# Altium project PROC114E3_SCH.PrjPcb (part 11 of 22)

## Sheet 24.SchDoc
size 513 x 386 mm
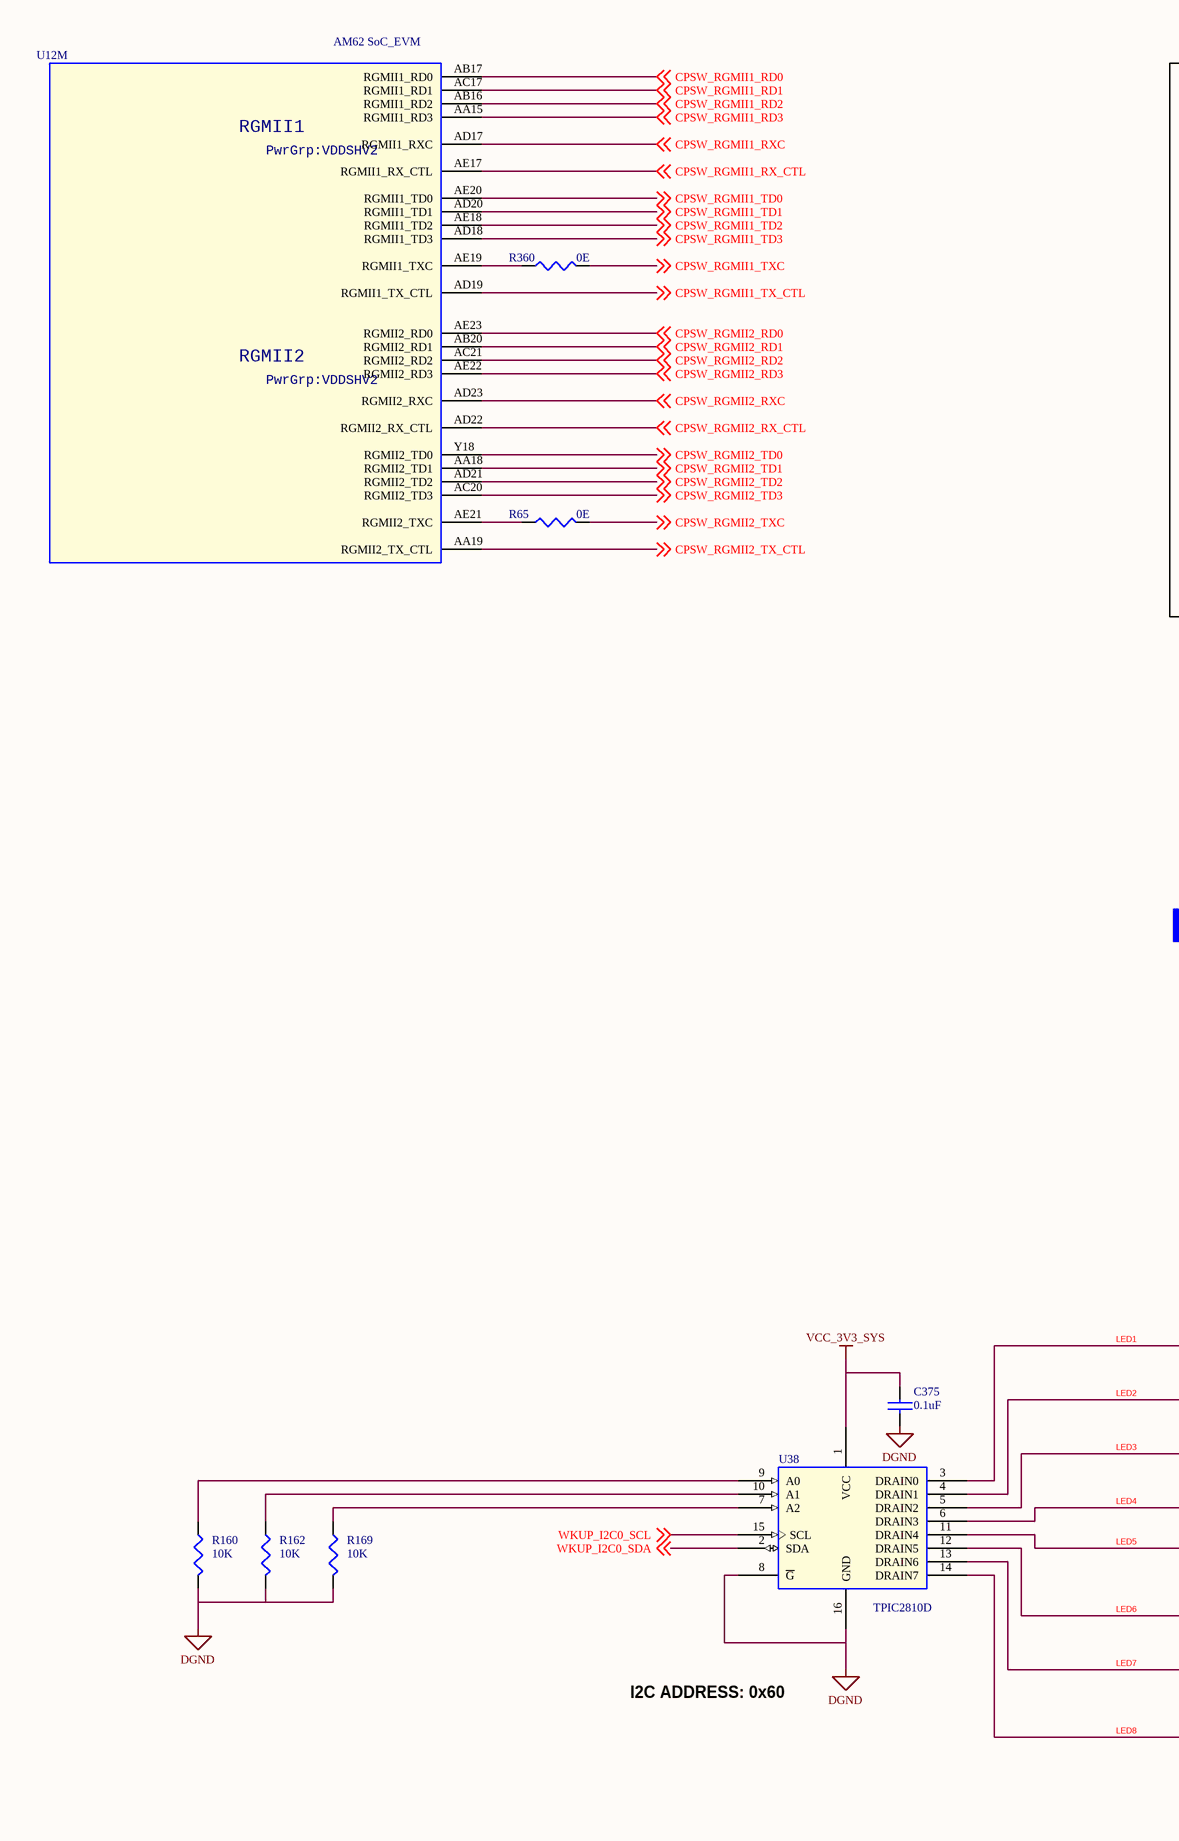
[diagram p37: 24.SchDoc, left]
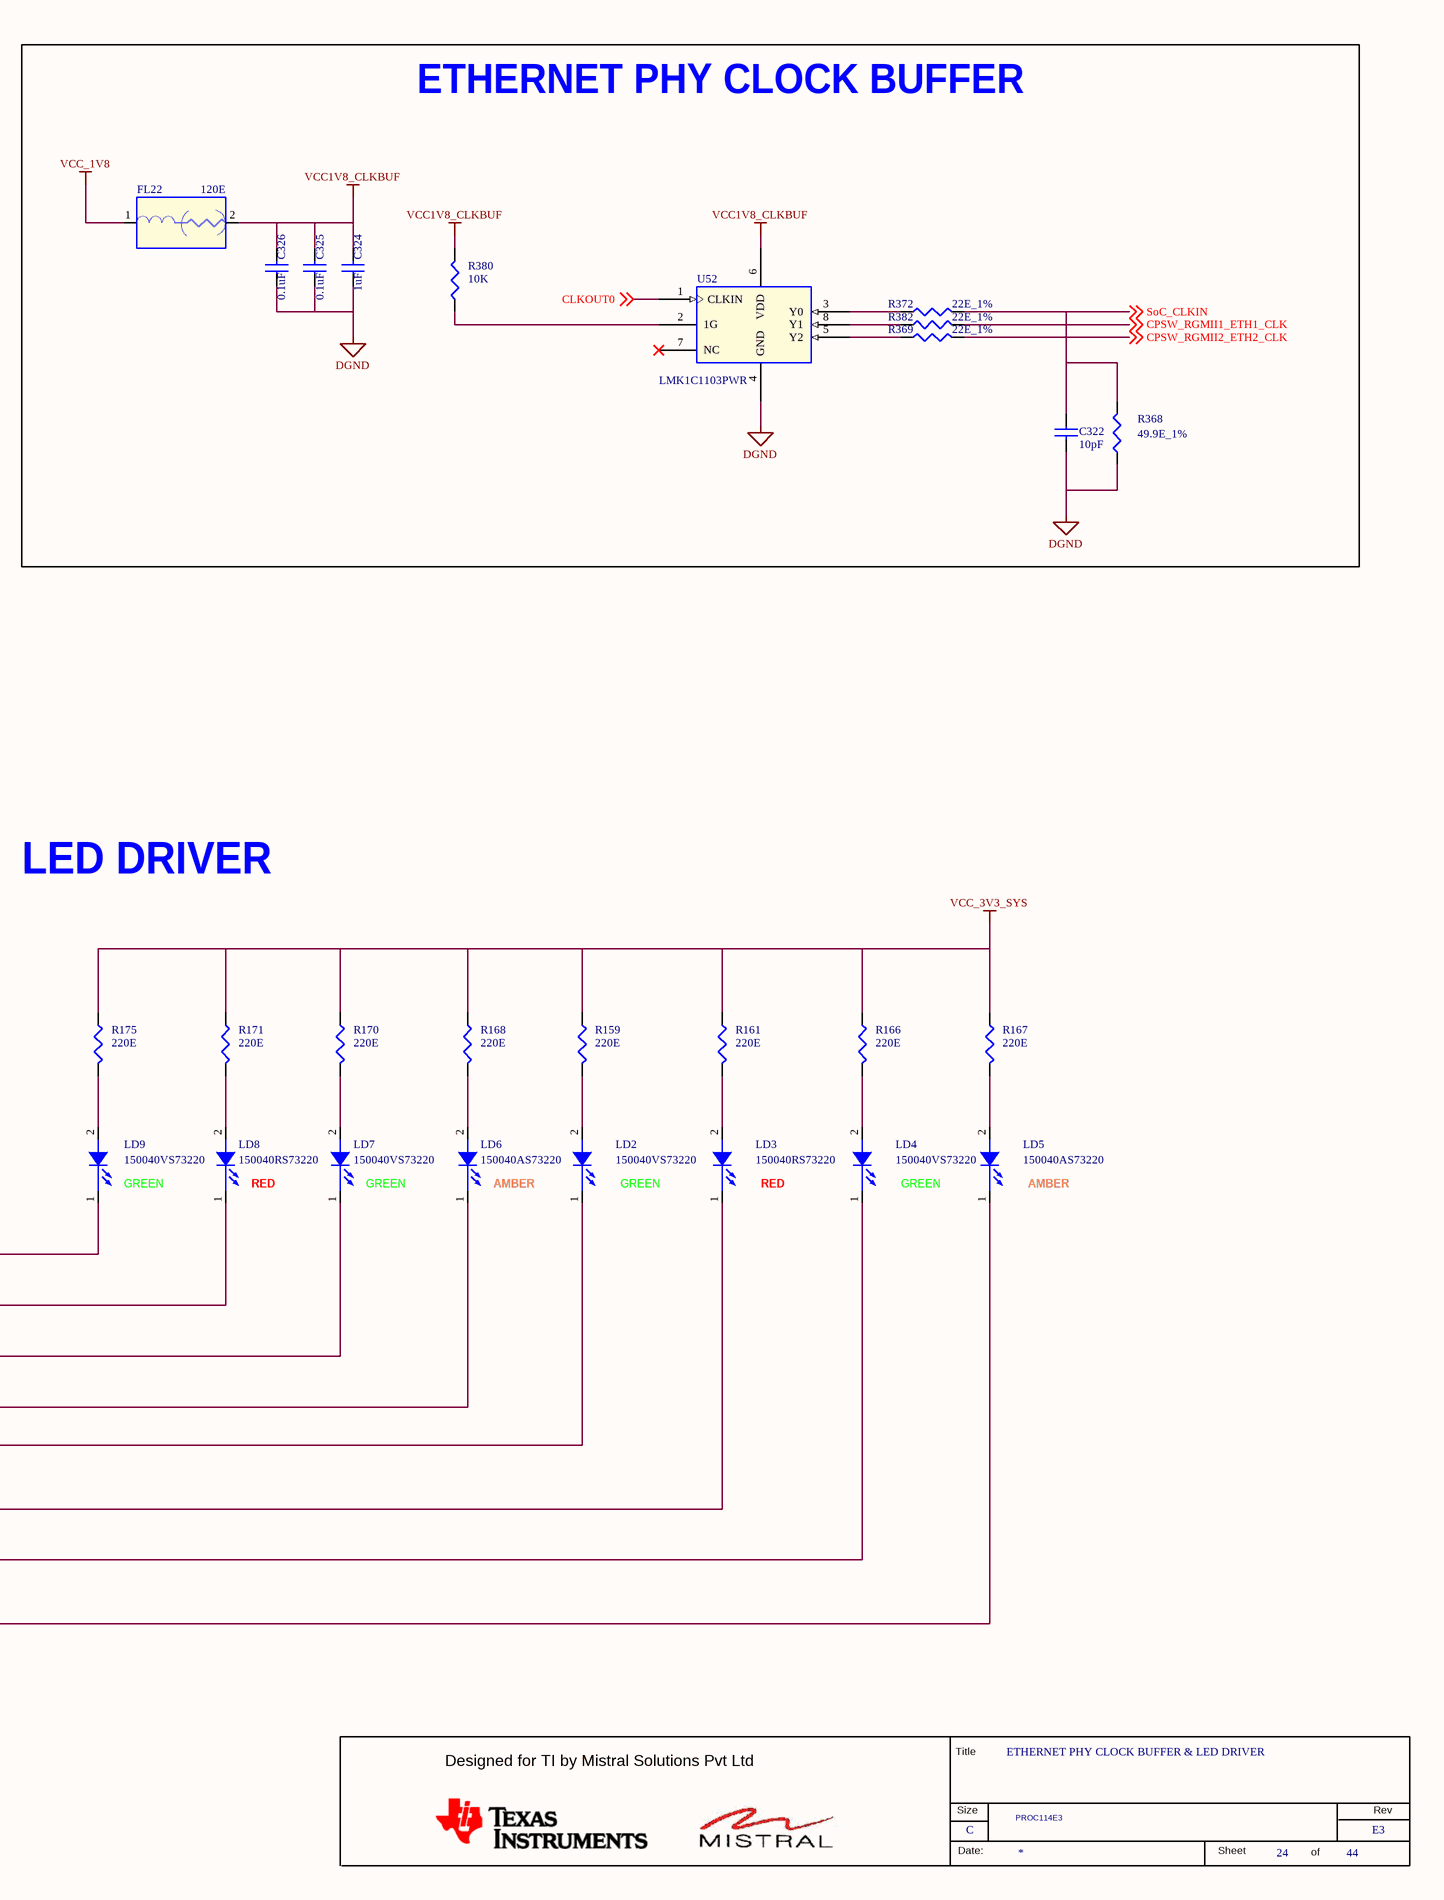
[diagram p38: 24.SchDoc, right]

### Parts
(Parts that share a designator on the sheet are numbered #1, #2 ... from top to bottom, then left to right.)
*#24  RevCode: E3  Title: ETHERNET PHY CLOCK BUFFER & LED DRIVER  Page Size: C  Page Number: 24  Page Count: 44  Variant Name: PROC114E3  (hidden comment: MISTRAL_TITLEBLK_CSIZE)  (graphical)
C322  10pF  [CAP0201_0-5]
C324  1uF  [CAP0201_0-5]
C325  0.1uF  [CAP0201_0-5]
C326  0.1uF  [CAP0201_0-5]
C375  0.1uF  [CAP0201_0-5]
FL22  120E  [EMIFIL_BLM15A_0402_0-6]
LD2  150040VS73220  [LED_150040GS73220_40X20_SMD_0-4]
LD3  150040RS73220  [LED_150040GS73220_40X20_SMD_0-4]
LD4  150040VS73220  [LED_150040GS73220_40X20_SMD_0-4]
LD5  150040AS73220  [LED_150040GS73220_40X20_SMD_0-4]
LD6  150040AS73220  [LED_150040GS73220_40X20_SMD_0-4]
LD7  150040VS73220  [LED_150040GS73220_40X20_SMD_0-4]
LD8  150040RS73220  [LED_150040GS73220_40X20_SMD_0-4]
LD9  150040VS73220  [LED_150040GS73220_40X20_SMD_0-4]
R65  0E  [RES0402_0-5]
R159  220E  [RES0402_0-5]
R160  10K  [RES0201_0-5]
R161  220E  [RES0402_0-5]
R162  10K  [RES0201_0-5]
R166  220E  [RES0402_0-5]
R167  220E  [RES0402_0-5]
R168  220E  [RES0402_0-5]
R169  10K  [RES0201_0-5]
R170  220E  [RES0402_0-5]
R171  220E  [RES0402_0-5]
R175  220E  [RES0402_0-5]
R360  0E  [RES0402_0-5]
R368  49.9E_1%  [RES0402_0-5]
R369  22E_1%  [RES0201_0-5]
R372  22E_1%  [RES0201_0-5]
R380  10K  [RES0201_0-5]
R382  22E_1%  [RES0201_0-5]
U12#2  AM62 SoC_EVM  [BGA425_19-68_510X510_0-7]  (part M of 18)
U38  TPIC2810D  [SOIC16_1-8]
U52  LMK1C1103PWR  [TSSOP8_25-59_125X180_1-2]

### Blocks framed on the sheet
ETHERNET PHY CLOCK BUFFER: C322 C324-C326 FL22 R368 R369 R372 R380 R382 U52

### Nets
DGND: C322.2 C324.1 C325.1 C326.1 C375.2 R160.2 R162.2 R169.2 R368.1 U38.8(~{G}) U38.16(GND) U52.4(GND)
VCC1V8_CLKBUF: C324.2 C325.2 C326.2 FL22.2 R380.2 U52.6(VDD)
VCC_1V8: FL22.1
VCC_3V3_SYS: C375.1 R159.1 R161.1 R166.1 R167.1 R168.1 R170.1 R171.1 R175.1 U38.1(VCC)
CLKOUT0: U52.1(CLKIN) ; off-sheet CLKOUT0
CPSW_RGMII1_ETH1_CLK: R382.2 ; off-sheet CPSW_RGMII1_ETH1_CLK
CPSW_RGMII1_RD0: U12#2.AB17(RGMII1_RD0) ; off-sheet CPSW_RGMII1_RD0
CPSW_RGMII1_RD1: U12#2.AC17(RGMII1_RD1) ; off-sheet CPSW_RGMII1_RD1
CPSW_RGMII1_RD2: U12#2.AB16(RGMII1_RD2) ; off-sheet CPSW_RGMII1_RD2
CPSW_RGMII1_RD3: U12#2.AA15(RGMII1_RD3) ; off-sheet CPSW_RGMII1_RD3
CPSW_RGMII1_RX_CTL: U12#2.AE17(RGMII1_RX_CTL) ; off-sheet CPSW_RGMII1_RX_CTL
CPSW_RGMII1_RXC: U12#2.AD17(RGMII1_RXC) ; off-sheet CPSW_RGMII1_RXC
CPSW_RGMII1_TD0: U12#2.AE20(RGMII1_TD0) ; off-sheet CPSW_RGMII1_TD0
CPSW_RGMII1_TD1: U12#2.AD20(RGMII1_TD1) ; off-sheet CPSW_RGMII1_TD1
CPSW_RGMII1_TD2: U12#2.AE18(RGMII1_TD2) ; off-sheet CPSW_RGMII1_TD2
CPSW_RGMII1_TD3: U12#2.AD18(RGMII1_TD3) ; off-sheet CPSW_RGMII1_TD3
CPSW_RGMII1_TX_CTL: U12#2.AD19(RGMII1_TX_CTL) ; off-sheet CPSW_RGMII1_TX_CTL
CPSW_RGMII1_TXC: R360.2 ; off-sheet CPSW_RGMII1_TXC
CPSW_RGMII2_ETH2_CLK: R369.2 ; off-sheet CPSW_RGMII2_ETH2_CLK
CPSW_RGMII2_RD0: U12#2.AE23(RGMII2_RD0) ; off-sheet CPSW_RGMII2_RD0
CPSW_RGMII2_RD1: U12#2.AB20(RGMII2_RD1) ; off-sheet CPSW_RGMII2_RD1
CPSW_RGMII2_RD2: U12#2.AC21(RGMII2_RD2) ; off-sheet CPSW_RGMII2_RD2
CPSW_RGMII2_RD3: U12#2.AE22(RGMII2_RD3) ; off-sheet CPSW_RGMII2_RD3
CPSW_RGMII2_RX_CTL: U12#2.AD22(RGMII2_RX_CTL) ; off-sheet CPSW_RGMII2_RX_CTL
CPSW_RGMII2_RXC: U12#2.AD23(RGMII2_RXC) ; off-sheet CPSW_RGMII2_RXC
CPSW_RGMII2_TD0: U12#2.Y18(RGMII2_TD0) ; off-sheet CPSW_RGMII2_TD0
CPSW_RGMII2_TD1: U12#2.AA18(RGMII2_TD1) ; off-sheet CPSW_RGMII2_TD1
CPSW_RGMII2_TD2: U12#2.AD21(RGMII2_TD2) ; off-sheet CPSW_RGMII2_TD2
CPSW_RGMII2_TD3: U12#2.AC20(RGMII2_TD3) ; off-sheet CPSW_RGMII2_TD3
CPSW_RGMII2_TX_CTL: U12#2.AA19(RGMII2_TX_CTL) ; off-sheet CPSW_RGMII2_TX_CTL
CPSW_RGMII2_TXC: R65.2 ; off-sheet CPSW_RGMII2_TXC
LED1: LD9.1(CATHODE) U38.3(DRAIN0)
LED2: LD8.1(CATHODE) U38.4(DRAIN1)
LED3: LD7.1(CATHODE) U38.5(DRAIN2)
LED4: LD6.1(CATHODE) U38.6(DRAIN3)
LED5: LD2.1(CATHODE) U38.11(DRAIN4)
LED6: LD3.1(CATHODE) U38.12(DRAIN5)
LED7: LD4.1(CATHODE) U38.13(DRAIN6)
LED8: LD5.1(CATHODE) U38.14(DRAIN7)
SoC_CLKIN: C322.1 R368.2 R372.2 ; off-sheet SoC_CLKIN
WKUP_I2C0_SCL: U38.15(SCL) ; off-sheet WKUP_I2C0_SCL
WKUP_I2C0_SDA: U38.2(SDA) ; off-sheet WKUP_I2C0_SDA
NetLD2_2: LD2.2(ANODE) R159.2
NetLD3_2: LD3.2(ANODE) R161.2
NetLD4_2: LD4.2(ANODE) R166.2
NetLD5_2: LD5.2(ANODE) R167.2
NetLD6_2: LD6.2(ANODE) R168.2
NetLD7_2: LD7.2(ANODE) R170.2
NetLD8_2: LD8.2(ANODE) R171.2
NetLD9_2: LD9.2(ANODE) R175.2
NetR65_1: R65.1 U12#2.AE21(RGMII2_TXC)
NetR160_1: R160.1 U38.9(A0)
NetR162_1: R162.1 U38.10(A1)
NetR169_1: R169.1 U38.7(A2)
NetR360_1: R360.1 U12#2.AE19(RGMII1_TXC)
NetR369_1: R369.1 U52.5(Y2)
NetR372_1: R372.1 U52.3(Y0)
NetR380_1: R380.1 U52.2(1G)
NetR382_1: R382.1 U52.8(Y1)

Not connected (* = marked no-connect by the designer): U52 7(NC)*

### Notes on the sheet
- LED DRIVER
- (near LD9) GREEN
- (near LD8) RED
- (near LD7) GREEN
- (near LD6) AMBER
- (near LD2) GREEN
- (near LD3) RED
- GREEN
- (near LD5) AMBER
- I2C ADDRESS: 0x60
- (in symbol AM62-EVM_BGA425, part M) RGMII1; PwrGrp:VDDSHV2; RGMII2
- (in symbol MISTRAL_TITLEBLK_CSIZE) Title; Designed for TI by Mistral Solutions Pvt Ltd; Size; Rev; Date:; Sheet; of

### Library data of the parts
*#24 = MISTRAL_TITLEBLK_CSIZE: Issue: 1.0; Page Create Date: March  8, 1995; Page Modify Date: *; Schematic Page Count: 44; Schematic Page Number: 24
C322 = CAP_Dup2: CAP CERAMIC 10pF 25V 5% HI-Q C0G(NP0) 0201; Part_type: CAPACITORS\CERAMIC; Mfr_part_number: GJM0335C1E100JB01D; Mfr_name: MURATA; Mistral Part No: 120016120010-R; Custom_Duty: 15%; Customs_HS_Code: 85322990; Wattage: NA; Project: OCTBTS5200; Footprint Path: Y:\MIS_DATABASE\Library\ALTIUM_TOOL\PCB_FOOTPRINTS\Altium_Footprint_Lib.PcbLib; Library Path: Y:\MIS_DATABASE\Library\ALTIUM_TOOL\SCHEMATICS_PARTS\MS_DISCRETE_Library.schlib; MECHANICAL 3D STEP FILE: CAP0201_0-5; Chkd/date: VASANTHA/081216; Crtd /date: MANIRAJA/081216; Datasheet: Y:\MIS_DATABASE\DATASHEETS\CAPACITORS\MURATA-GXX-SER_NOV17.PDF; Temperature: -55°C+125°C; Weight: 0.33mg; Height: 0.33MM; Library Ref: CAP; Distributor_part_number: 490-13312-1-ND; Distributor_name: DIGIKEY; Package: 0201; Voltage: 25V; Tolerance: 5%; Footprint Ref: CAP0201_0-5; PCB Footprint: CAP0201_0-5
C324 = CAP_Dup2: CAP CERAMIC 1uF 16V 20% X5R 0201; Mistral Part No: 120018090038-R; Mfr_name: MURATA; Mfr_part_number: GRM033R61C105ME15D; Part_type: CAPACITORS\CERAMIC; Project: QCS610_NANOSOM; Wattage: NA; Customs_HS_Code: 85322990; Custom_Duty: 15%; Footprint Ref: CAP0201_0-5; Library Ref: CAP; Tolerance: 20%; Voltage: 16V; Package: 0201; Distributor_name: DIGIKEY; Distributor_part_number: 490-18654-1-ND; Height: 0.39MM; Weight: 0.33mg; Temperature: -55°C+85°C; Datasheet: Y:\MIS_DATABASE\DATASHEETS\CAPACITORS\GRM033R61C105ME15.PDF; Crtd /date: ALVY/260520; Chkd/date: MANIRAJA/300520; MECHANICAL 3D STEP FILE: CAP0201_0-5; Library Path: Y:\MIS_DATABASE\Library\ALTIUM_TOOL\SCHEMATICS_PARTS\MS_DISCRETE_Library.schlib; Footprint Path: Y:\MIS_DATABASE\Library\ALTIUM_TOOL\PCB_FOOTPRINTS\Altium_Footprint_Lib.PcbLib; PCB Footprint: CAP0201_0-5
C325 C326 C375 = CAP_Dup2: CAP CERAMIC 0.1uF 16V 10% X5R 0201; Alt_Mfr_part_number: CC0402KRX5R8BB104; Mistral Part No: 120009030072-R; Mfr_name: MURATA; Mfr_part_number: GRM033R61C104KE14D; Part_type: CAPACITORS\CERAMIC; Alt_Mfr_name: YAGEO AMERICA; Project: TI_MAXIE_CPB; Wattage: NA; Customs_HS_Code: 85322990; Custom_Duty: 15%; Tolerance: 10%; Voltage: 16V; Package: 0201; Distributor_name: DIGIKEY; Distributor_part_number: 490-14305-1-ND; Height: 0.33MM; Weight: 0.33mg; Temperature: -55°C+85°C; Datasheet: Y:\MIS_DATABASE\DATASHEETS\CAPACITORS\GRM033R61C104KE14.PDF; Crtd /date: MANIRAJA/230118; Chkd/date: MANIRAJA/230118; MECHANICAL 3D STEP FILE: CAP0201_0-5; Library Ref: CAP; Footprint Ref: CAP0201_0-5; Library Path: Y:\MIS_DATABASE\Library\ALTIUM_TOOL\SCHEMATICS_PARTS\MS_DISCRETE_Library.schlib; Footprint Path: Y:\MIS_DATABASE\Library\ALTIUM_TOOL\PCB_FOOTPRINTS\Altium_Footprint_Lib.PcbLib; PCB Footprint: CAP0201_0-5
FL22 = EMIFILTER_IND: IND FERRITE BEAD CHIP 120E 2A 0402; Mistral Part No: 130013060022-R; Mfr_name: MURATA; Mfr_part_number: BLM15PX121SN1D; Part_type: INDUCTOR; Project: GEN_3-8; Tolerance: 25%; Voltage: NA; Customs_HS_Code: 85369090; Custom_Duty: 24%; Wattage: NA; Package: 0402; Distributor_name: DIGIKEY; Distributor_part_number: 490-9656-1-ND; Library Ref: EMIFILTER_IND; Height: 0.55MM; Weight: 1mg; Temperature: -55°C+125°C; Datasheet: Y:\MIS_DATABASE\DATASHEETS\DISCRETES\INDUCTORS\BLM15-SN1-SER.PDF; Crtd /date: USMAN/170613; Chkd/date: NAVEED/241114; Footprint Ref: EMIFIL_BLM15A_0402_0-6; MECHANICAL 3D STEP FILE: EMIFIL_BLM15A_0402_0-6; Library Path: Y:\MIS_DATABASE\Library\ALTIUM_TOOL\SCHEMATICS_PARTS\MS_FILTER_Library.schlib; Footprint Path: Y:\MIS_DATABASE\Library\ALTIUM_TOOL\PCB_FOOTPRINTS\Altium_Footprint_Lib.PcbLib; PCB Footprint: EMIFIL_BLM15A_0402_0-6
LD2 LD4 LD7 = DIODE_LED: DIODE LED BRIGHT GREEN SMD; Part_type: OPTO\LED; Mfr_name: WURTH ELECTRONIK; Mistral Part No: 130020110071-R; Custom_Duty: 24%; Customs_HS_Code: 85439000; Wattage: NA; Project: AM64X_SKEVM; Footprint Path: Y:\MIS_DATABASE\Library\ALTIUM_TOOL\PCB_FOOTPRINTS\Altium_Footprint_Lib.PcbLib; Library Path: Y:\MIS_DATABASE\Library\ALTIUM_TOOL\SCHEMATICS_PARTS\MS_OPTO_Library.schlib; MECHANICAL 3D STEP FILE: LED_150040GS73220_40X20_SMD_0-4; Chkd/date: MANIRAJA/261120; Crtd /date: ALVY/261120; Datasheet: Y:\MIS_DATABASE\DATASHEETS\DISCRETES\LEDS\150040VS73220.PDF; Temperature: -40°C+85°C; Weight: 29.3mg; Height: 0.35MM; Library Ref: DIODE_LED; Distributor_part_number: 732-13425-1-ND; Distributor_name: DIGIKEY; Package: SMD; Voltage: NA; Tolerance: NA; Mfr_part_number: 150040VS73220; Footprint Ref: LED_150040GS73220_40X20_SMD_0-4; PCB Footprint: LED_150040GS73220_40X20_SMD_0-4
LD3 = DIODE_LED: DIODE LED RED SMD; Mistral Part No: 130020090020-R; Mfr_name: WURTH ELECTRONICS; Part_type: OPTO\LED; Project: AM64X_SKEVM; Tolerance: NA; Customs_HS_Code: 85439000; Custom_Duty: 24%; Footprint Ref: LED_150040GS73220_40X20_SMD_0-4; Mfr_part_number: 150040RS73220; Voltage: NA; Wattage: NA; Package: SMD; Distributor_name: DIGIKEY; Distributor_part_number: 732-13422-1-ND; Library Ref: DIODE_LED; Height: 0.35MM; Weight: 29.3mg; Temperature: -40°C+85°C; Datasheet: Y:\MIS_DATABASE\DATASHEETS\DISCRETES\LEDS\150040RS73220.PDF; Crtd /date: ALVY/100920; Chkd/date: MANIRAJA/100920; MECHANICAL 3D STEP FILE: LED_150040GS73220_40X20_SMD_0-4; Library Path: Y:\MIS_DATABASE\Library\ALTIUM_TOOL\SCHEMATICS_PARTS\MS_OPTO_Library.schlib; Footprint Path: Y:\MIS_DATABASE\Library\ALTIUM_TOOL\PCB_FOOTPRINTS\Altium_Footprint_Lib.PcbLib; PCB Footprint: LED_150040GS73220_40X20_SMD_0-4
LD5 LD6 = DIODE_LED: DIODE LED AMBER SMD; Part_type: OPTO\LED; Mfr_name: WURTH ELECTRONICS; Mistral Part No: 130020090022-R; Custom_Duty: 24%; Customs_HS_Code: 85439000; Wattage: NA; Project: AM64X_SKEVM; Footprint Path: Y:\MIS_DATABASE\Library\ALTIUM_TOOL\PCB_FOOTPRINTS\Altium_Footprint_Lib.PcbLib; Library Path: Y:\MIS_DATABASE\Library\ALTIUM_TOOL\SCHEMATICS_PARTS\MS_OPTO_Library.schlib; MECHANICAL 3D STEP FILE: LED_150040GS73220_40X20_SMD_0-4; Chkd/date: MANIRAJA/100920; Crtd /date: ALVY/100920; Datasheet: Y:\MIS_DATABASE\DATASHEETS\DISCRETES\LEDS\150040AS73220.PDF; Temperature: -40°C+85°C; Weight: 29.3mg; Height: 0.35MM; Library Ref: DIODE_LED; Distributor_part_number: 732-13423-1-ND; Distributor_name: DIGIKEY; Package: SMD; Voltage: NA; Tolerance: NA; Mfr_part_number: 150040AS73220; Footprint Ref: LED_150040GS73220_40X20_SMD_0-4; PCB Footprint: LED_150040GS73220_40X20_SMD_0-4
LD8 = DIODE_LED: DIODE LED RED SMD; Part_type: OPTO\LED; Mfr_name: WURTH ELECTRONICS; Mistral Part No: 130020090020-R; Custom_Duty: 24%; Customs_HS_Code: 85439000; Wattage: NA; Project: AM64X_SKEVM; Footprint Path: Y:\MIS_DATABASE\Library\ALTIUM_TOOL\PCB_FOOTPRINTS\Altium_Footprint_Lib.PcbLib; Library Path: Y:\MIS_DATABASE\Library\ALTIUM_TOOL\SCHEMATICS_PARTS\MS_OPTO_Library.schlib; MECHANICAL 3D STEP FILE: LED_150040GS73220_40X20_SMD_0-4; Chkd/date: MANIRAJA/100920; Crtd /date: ALVY/100920; Datasheet: Y:\MIS_DATABASE\DATASHEETS\DISCRETES\LEDS\150040RS73220.PDF; Temperature: -40°C+85°C; Weight: 29.3mg; Height: 0.35MM; Library Ref: DIODE_LED; Distributor_part_number: 732-13422-1-ND; Distributor_name: DIGIKEY; Package: SMD; Voltage: NA; Tolerance: NA; Mfr_part_number: 150040RS73220; Footprint Ref: LED_150040GS73220_40X20_SMD_0-4; PCB Footprint: LED_150040GS73220_40X20_SMD_0-4
LD9 = DIODE_LED: DIODE LED BRIGHT GREEN SMD; Mistral Part No: 130020110071-R; Mfr_name: WURTH ELECTRONIK; Part_type: OPTO\LED; Project: AM64X_SKEVM; Tolerance: NA; Customs_HS_Code: 85439000; Custom_Duty: 24%; Footprint Ref: LED_150040GS73220_40X20_SMD_0-4; Mfr_part_number: 150040VS73220; Voltage: NA; Wattage: NA; Package: SMD; Distributor_name: DIGIKEY; Distributor_part_number: 732-13425-1-ND; Library Ref: DIODE_LED; Height: 0.35MM; Weight: 29.3mg; Temperature: -40°C+85°C; Datasheet: Y:\MIS_DATABASE\DATASHEETS\DISCRETES\LEDS\150040VS73220.PDF; Crtd /date: ALVY/261120; Chkd/date: MANIRAJA/261120; MECHANICAL 3D STEP FILE: LED_150040GS73220_40X20_SMD_0-4; Library Path: Y:\MIS_DATABASE\Library\ALTIUM_TOOL\SCHEMATICS_PARTS\MS_OPTO_Library.schlib; Footprint Path: Y:\MIS_DATABASE\Library\ALTIUM_TOOL\PCB_FOOTPRINTS\Altium_Footprint_Lib.PcbLib; PCB Footprint: LED_150040GS73220_40X20_SMD_0-4
R65 R360 = RESISTOR_Dup6: RES 0E 1/16W JUMPER 0402; Part_type: RESISTORS\FIXED; Mfr_part_number: CRCW04020000Z0ED; Mfr_name: VISHAY; Mistral Part No: 110010080019-R; SIGNAL_MODEL: RESISTOR_RES0402_0-5_0E_0E; Custom_Duty: 15%; Customs_HS_Code: 85332119; Voltage: NA; Project: PB_BUGBASE; Footprint Path: Y:\MIS_DATABASE\Library\ALTIUM_TOOL\PCB_FOOTPRINTS\Altium_Footprint_Lib.PcbLib; Library Path: Y:\MIS_DATABASE\Library\ALTIUM_TOOL\SCHEMATICS_PARTS\MS_DISCRETE_Library.schlib; MECHANICAL 3D STEP FILE: RES0402_0-5; Chkd/date: VASANTHA/201216; Crtd /date: MUDDU/190810; Datasheet: Y:\MIS_DATABASE\DATASHEETS\RESISTORS\CRCW0603.PDF; Temperature: -55°C+155°C; Weight: 0.65mg; Height: 0.40MM; Library Ref: RESISTOR; Distributor_part_number: 541-0.0JCT-ND; Distributor_name: DIGIKEY; Package: 0402; Wattage: 1/16W; Tolerance: NA; Footprint Ref: RES0402_0-5; PCB Footprint: RES0402_0-5
R159 R168 R170 R171 R175 = RESISTOR_Dup6: RES 220E 1/10W 5% 0402; Part_type: RESISTORS\FIXED; Mfr_part_number: ERJ-2GEJ221X; Mfr_name: PANASONIC-ECG; Mistral Part No: 110009030506-R; Custom_Duty: 15%; Customs_HS_Code: 85332119; Voltage: NA; Project: RED EYE; Footprint Path: Y:\MIS_DATABASE\Library\ALTIUM_TOOL\PCB_FOOTPRINTS\Altium_Footprint_Lib.PcbLib; Library Path: Y:\MIS_DATABASE\Library\ALTIUM_TOOL\SCHEMATICS_PARTS\MS_DISCRETE_Library.schlib; MECHANICAL 3D STEP FILE: RES0402_0-5; Chkd/date: VASANTHA/291216; Crtd /date: GEETHA/260406; Datasheet: Y:\MIS_DATABASE\DATASHEETS\RESISTORS\PAN-ERJSER_NOV17.PDF; Temperature: -55°C+155°C; Weight: 0.8mg; Height: 0.40MM; Footprint Ref: RES0402_0-5; Library Ref: RESISTOR; Distributor_part_number: P220JCT-ND; Distributor_name: DIGIKEY; Package: 0402; Wattage: 1/10W; Tolerance: 5%; PCB Footprint: RES0402_0-5; Manufacturer: PANASONIC-ECG
R160 R380 = RESISTOR_Dup6: RES 10K 1/20W 5% 0201; Part_type: RESISTORS\FIXED; Mfr_part_number: RC0201JR-0710KL; Mfr_name: YAGEO AMERICA; Mistral Part No: 110010070051-R; Custom_Duty: 15%; Customs_HS_Code: 85332119; Voltage: NA; Project: GOLDEN-I LITE; Footprint Path: Y:\MIS_DATABASE\Library\ALTIUM_TOOL\PCB_FOOTPRINTS\Altium_Footprint_Lib.PcbLib; Library Path: Y:\MIS_DATABASE\Library\ALTIUM_TOOL\SCHEMATICS_PARTS\MS_DISCRETE_Library.schlib; MECHANICAL 3D STEP FILE: RES0201_0-5; Chkd/date: MANIRAJA/050517; Crtd /date: MANIRAJA/050517; Datasheet: Y:\MIS_DATABASE\DATASHEETS\RESISTORS\RCXXXXL-SER_MAR18.PDF; Temperature: -55°C+125°C; Weight: 0.17mg; Height: 0.26MM; Footprint Ref: RES0201_0-5; Library Ref: RESISTOR; Distributor_part_number: 311-10KNCT-ND; Distributor_name: DIGIKEY; Package: 0201; Wattage: 1/20W; Tolerance: 5%; PCB Footprint: RES0201_0-5
R161 R166 R167 = RESISTOR_Dup6: RES 220E 1/10W 5% 0402; Mistral Part No: 110009030506-R; Mfr_name: PANASONIC-ECG; Mfr_part_number: ERJ-2GEJ221X; Part_type: RESISTORS\FIXED; Project: RED EYE; Voltage: NA; Customs_HS_Code: 85332119; Custom_Duty: 15%; Tolerance: 5%; Wattage: 1/10W; Package: 0402; Distributor_name: DIGIKEY; Distributor_part_number: P220JCT-ND; Library Ref: RESISTOR; Footprint Ref: RES0402_0-5; Height: 0.40MM; Weight: 0.8mg; Temperature: -55°C+155°C; Datasheet: Y:\MIS_DATABASE\DATASHEETS\RESISTORS\PAN-ERJSER_NOV17.PDF; Crtd /date: GEETHA/260406; Chkd/date: VASANTHA/291216; MECHANICAL 3D STEP FILE: RES0402_0-5; Library Path: Y:\MIS_DATABASE\Library\ALTIUM_TOOL\SCHEMATICS_PARTS\MS_DISCRETE_Library.schlib; Footprint Path: Y:\MIS_DATABASE\Library\ALTIUM_TOOL\PCB_FOOTPRINTS\Altium_Footprint_Lib.PcbLib; PCB Footprint: RES0402_0-5; Manufacturer: PANASONIC-ECG
R162 R169 = RESISTOR_Dup6: RES 10K 1/20W 5% 0201; Mistral Part No: 110010070051-R; Mfr_name: YAGEO AMERICA; Mfr_part_number: RC0201JR-0710KL; Part_type: RESISTORS\FIXED; Project: GOLDEN-I LITE; Voltage: NA; Customs_HS_Code: 85332119; Custom_Duty: 15%; Tolerance: 5%; Wattage: 1/20W; Package: 0201; Distributor_name: DIGIKEY; Distributor_part_number: 311-10KNCT-ND; Library Ref: RESISTOR; Footprint Ref: RES0201_0-5; Height: 0.26MM; Weight: 0.17mg; Temperature: -55°C+125°C; Datasheet: Y:\MIS_DATABASE\DATASHEETS\RESISTORS\RCXXXXL-SER_MAR18.PDF; Crtd /date: MANIRAJA/050517; Chkd/date: MANIRAJA/050517; MECHANICAL 3D STEP FILE: RES0201_0-5; Library Path: Y:\MIS_DATABASE\Library\ALTIUM_TOOL\SCHEMATICS_PARTS\MS_DISCRETE_Library.schlib; Footprint Path: Y:\MIS_DATABASE\Library\ALTIUM_TOOL\PCB_FOOTPRINTS\Altium_Footprint_Lib.PcbLib; PCB Footprint: RES0201_0-5
R368 = RESISTOR_Dup2: RES 49.9E 1/16W 1% 0402; Part_type: RESISTORS\FIXED; Mfr_part_number: CRCW040249R9FKEDC; Mfr_name: VISHAY; Mistral Part No: 110009030846-R; Custom_Duty: 15%; Customs_HS_Code: 85332119; Voltage: NA; Project: RFSU_RFTJ_CARD; Footprint Path: Y:\MIS_DATABASE\Library\ALTIUM_TOOL\PCB_FOOTPRINTS\Altium_Footprint_Lib.PcbLib; Library Path: Y:\MIS_DATABASE\Library\ALTIUM_TOOL\SCHEMATICS_PARTS\MS_DISCRETE_Library.schlib; MECHANICAL 3D STEP FILE: RES0402_0-5; Chkd/date: MANIRAJA/210519; Crtd /date: MANIRAJA/210519; Datasheet: Y:\MIS_DATABASE\DATASHEETS\RESISTORS\CRCW_C-SER.PDF; Temperature: -55°C+155°C; Weight: 0.65mg; Height: 0.35MM; Library Ref: RESISTOR; Distributor_part_number: 541-3967-1-ND; Distributor_name: DIGIKEY; Package: 0402; Wattage: 1/16W; Tolerance: 1%; Footprint Ref: RES0402_0-5; PCB Footprint: RES0402_0-5
R369 = RESISTOR_Dup1: RES 22E 1/20W 1% 0201; Part_type: RESISTORS\FIXED; Mfr_part_number: RC0201FR-0722RL; Mfr_name: YAGEO AMERICA; Mistral Part No: 110009030522-R; Custom_Duty: 15%; Customs_HS_Code: 85332119; Voltage: NA; Project: AM654x_SOM; Footprint Path: Y:\MIS_DATABASE\Library\ALTIUM_TOOL\PCB_FOOTPRINTS\Altium_Footprint_Lib.PcbLib; Library Path: Y:\MIS_DATABASE\Library\ALTIUM_TOOL\SCHEMATICS_PARTS\MS_DISCRETE_Library.schlib; MECHANICAL 3D STEP FILE: RES0201_0-5; Chkd/date: MANIRAJA/080319; Crtd /date: ALVY/080319; Datasheet: Y:\MIS_DATABASE\DATASHEETS\RESISTORS\RCXXXXL-SER_MAR18.PDF; Temperature: -55°C+125°C; Weight: 0.17mg; Height: 0.26MM; Library Ref: RESISTOR; Distributor_part_number: YAG2518CT-ND; Distributor_name: DIGIKEY; Package: 0201; Wattage: 1/20W; Tolerance: 1%; Footprint Ref: RES0201_0-5; PCB Footprint: RES0201_0-5
R372 R382 = RESISTOR_Dup1: RES 22E 1/20W 1% 0201; Mistral Part No: 110009030522-R; Mfr_name: YAGEO AMERICA; Mfr_part_number: RC0201FR-0722RL; Part_type: RESISTORS\FIXED; Project: AM654x_SOM; Voltage: NA; Customs_HS_Code: 85332119; Custom_Duty: 15%; Footprint Ref: RES0201_0-5; Tolerance: 1%; Wattage: 1/20W; Package: 0201; Distributor_name: DIGIKEY; Distributor_part_number: YAG2518CT-ND; Library Ref: RESISTOR; Height: 0.26MM; Weight: 0.17mg; Temperature: -55°C+125°C; Datasheet: Y:\MIS_DATABASE\DATASHEETS\RESISTORS\RCXXXXL-SER_MAR18.PDF; Crtd /date: ALVY/080319; Chkd/date: MANIRAJA/080319; MECHANICAL 3D STEP FILE: RES0201_0-5; Library Path: Y:\MIS_DATABASE\Library\ALTIUM_TOOL\SCHEMATICS_PARTS\MS_DISCRETE_Library.schlib; Footprint Path: Y:\MIS_DATABASE\Library\ALTIUM_TOOL\PCB_FOOTPRINTS\Altium_Footprint_Lib.PcbLib; PCB Footprint: RES0201_0-5
U12#2 = AM62-EVM_BGA425: IC AM62 SoC MICROPROCESSOR BGA425; Part_type: ICS\DIGITAL\MICROPROCESSOR; Mfr_name: TEXAS INSTRUMENTS; Mistral Part No: 141221060001; Custom_Duty: 15%; Customs_HS_Code: 85423100; Wattage: NA; Project: AM62_EVM_BRD; PCB Footprint: BGA425_19-68_510X510_0-7; Footprint Path: Y:\MIS_DATABASE\Library\ALTIUM_TOOL\PCB_FOOTPRINTS\Altium_Footprint_Lib.PcbLib; Library Path: Y:\MIS_DATABASE\Library\ALTIUM_TOOL\SCHEMATICS_PARTS\MS_MICROPROCESSOR_Library.schlib; MECHANICAL 3D STEP FILE: BGA425_19-68_510X510_0-7; RoHS: NA; Chkd/date: ALVY/110621; Crtd /date: MANIRAJA/110621; Datasheet: Y:\MIS_DATABASE\DATASHEETS\ICS\DIGITAL\MICROCONTROLLER\AM62-SoC_SVB.PDF; Temperature: NA; Weight: NA; Height: 0.65MM; Footprint Ref: BGA425_19-68_510X510_0-7; Library Ref: AM62-EVM_BGA425; Distributor_part_number: NA; Distributor_name: NA; Package: BGA425; Voltage: NA; Tolerance: NA; Mfr_part_number: AM62 SoC_EVM
U38 = TPIC2810D_SOIC16: IC 8-BIT LED DRIVER WITH I2C INTERFACE SOIC16; Mistral Part No: 141017080026-R; Mfr_name: TEXAS INSTRUMENTS; Part_type: ICS\INTERFACE; Project: TI_MAXIE_CPB; Tolerance: NA; Customs_HS_Code: 85423100; Custom_Duty: 15%; Mfr_part_number: TPIC2810D; Voltage: NA; Wattage: NA; Package: SOIC16; Distributor_name: DIGIKEY; Distributor_part_number: 296-13746-5-ND; Height: 1.75MM; Weight: NA; Temperature: -40°C+125°C; Datasheet: Y:\MIS_DATABASE\DATASHEETS\ICS\INTERFACE\TPIC2810D.PDF; Crtd /date: MANIRAJA/220817; Chkd/date: MANIRAJA/230817; MECHANICAL 3D STEP FILE: SOIC16_1-8; Library Ref: TPIC2810D_SOIC16; PCB Footprint: SOIC16_1-8
U52 = LMK1C1103_TSSOP8: IC 3-CHANNEL LVCMOS CLOCK BUFFER TSSOP8; Mistral Part No: 141020090002-R; Mfr_name: TEXAS INSTRUMENTS; Part_type: ICS\DIGITAL\COMBINATIONAL; Project: AM64X_SKEVM; Tolerance: NA; Customs_HS_Code: 85423100; Custom_Duty: 15%; Footprint Ref: TSSOP8_25-59_125X180_1-2; Mfr_part_number: LMK1C1103PWR; Voltage: NA; Wattage: NA; Package: TSSOP8; Distributor_name: DIGIKEY; Distributor_part_number: 296-LMK1C1103PWRCT-ND; Library Ref: LMK1C1103_TSSOP8; Height: 1.20MM; Weight: 34.1mg; Temperature: -40°C+125°C; Datasheet: Y:\MIS_DATABASE\DATASHEETS\ICS\DIGITAL\COMBINATIONAL\LMK1C110X.PDF; Crtd /date: ALVY/070920; Chkd/date: MANIRAJA/080920; MECHANICAL 3D STEP FILE: TSSOP8_25-59_125X180_1-2; Library Path: Y:\MIS_DATABASE\Library\ALTIUM_TOOL\SCHEMATICS_PARTS\MS_COMBINATIONAL_Library.schlib; Footprint Path: Y:\MIS_DATABASE\Library\ALTIUM_TOOL\PCB_FOOTPRINTS\Altium_Footprint_Lib.PcbLib; PCB Footprint: TSSOP8_25-59_125X180_1-2

## Sheet 25.SchDoc
size 513 x 386 mm
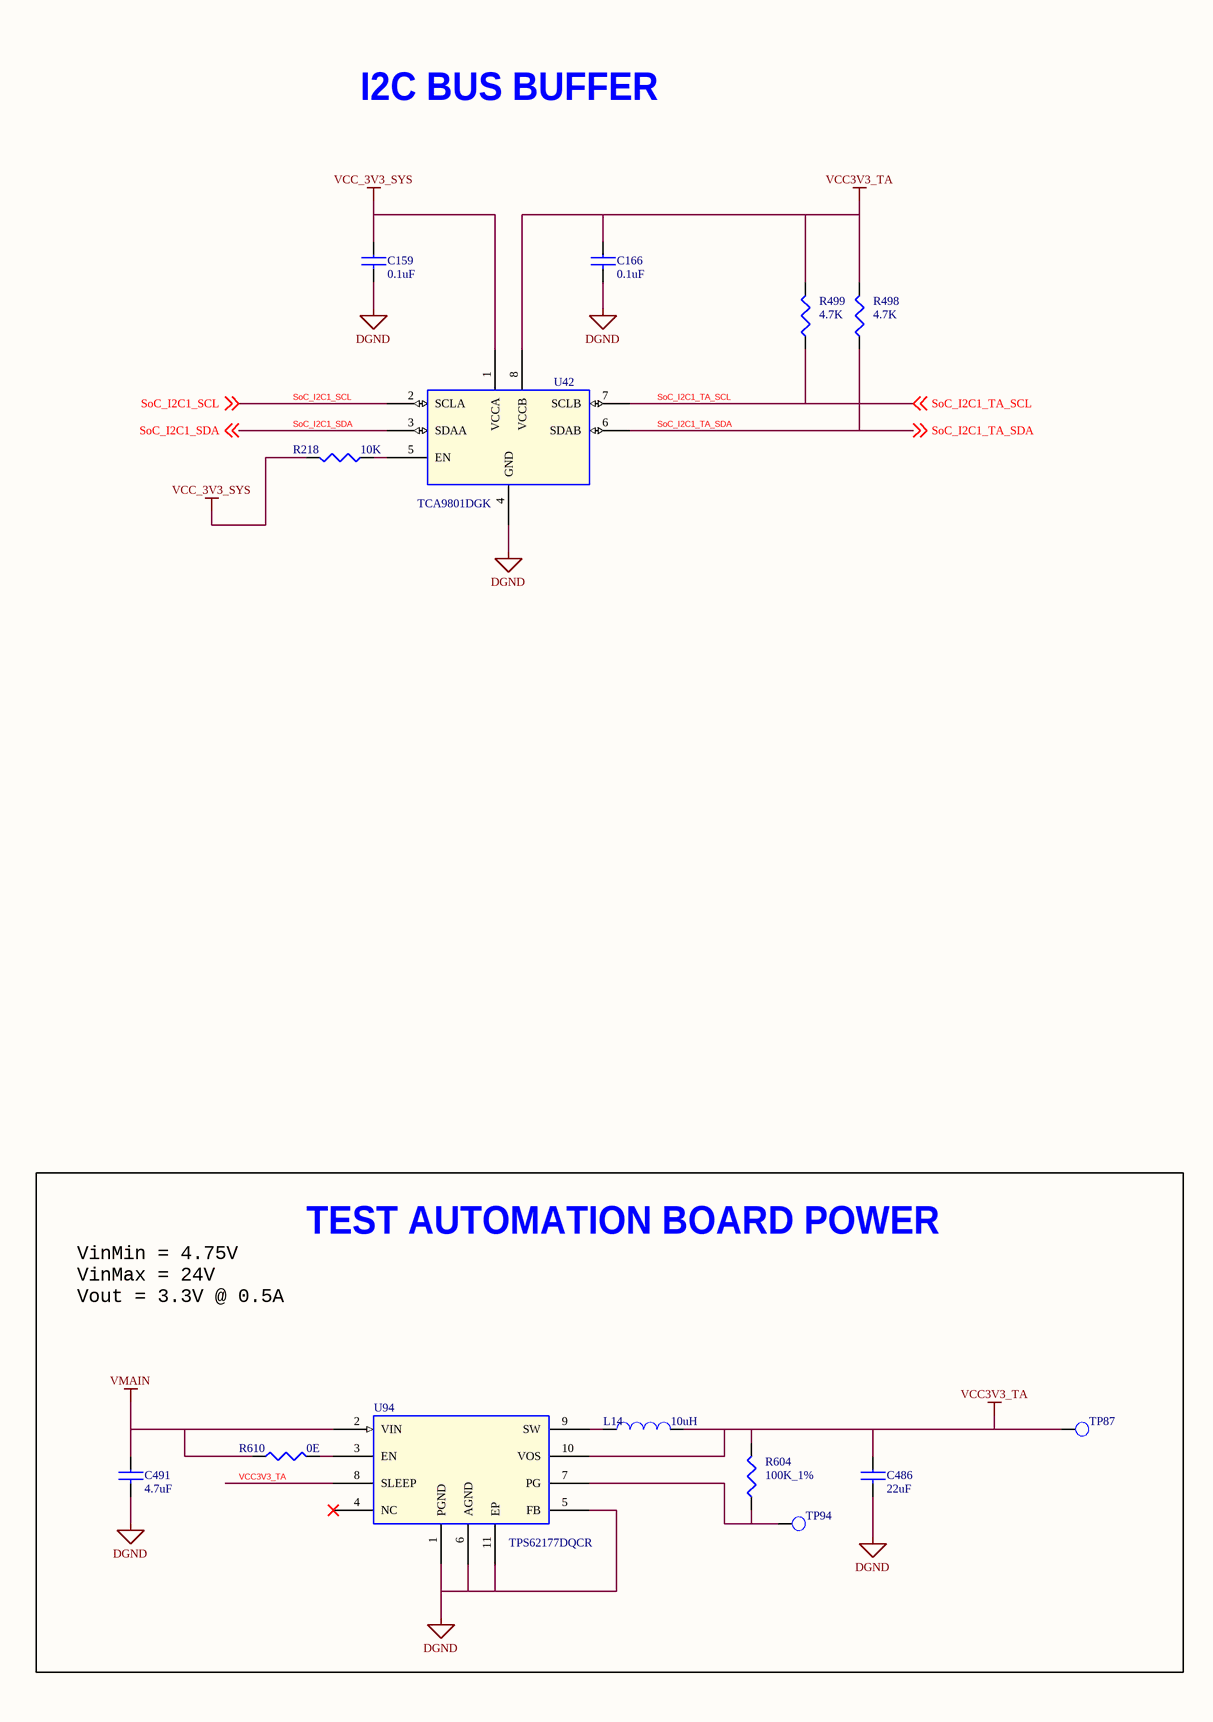
[diagram p39: 25.SchDoc, left]
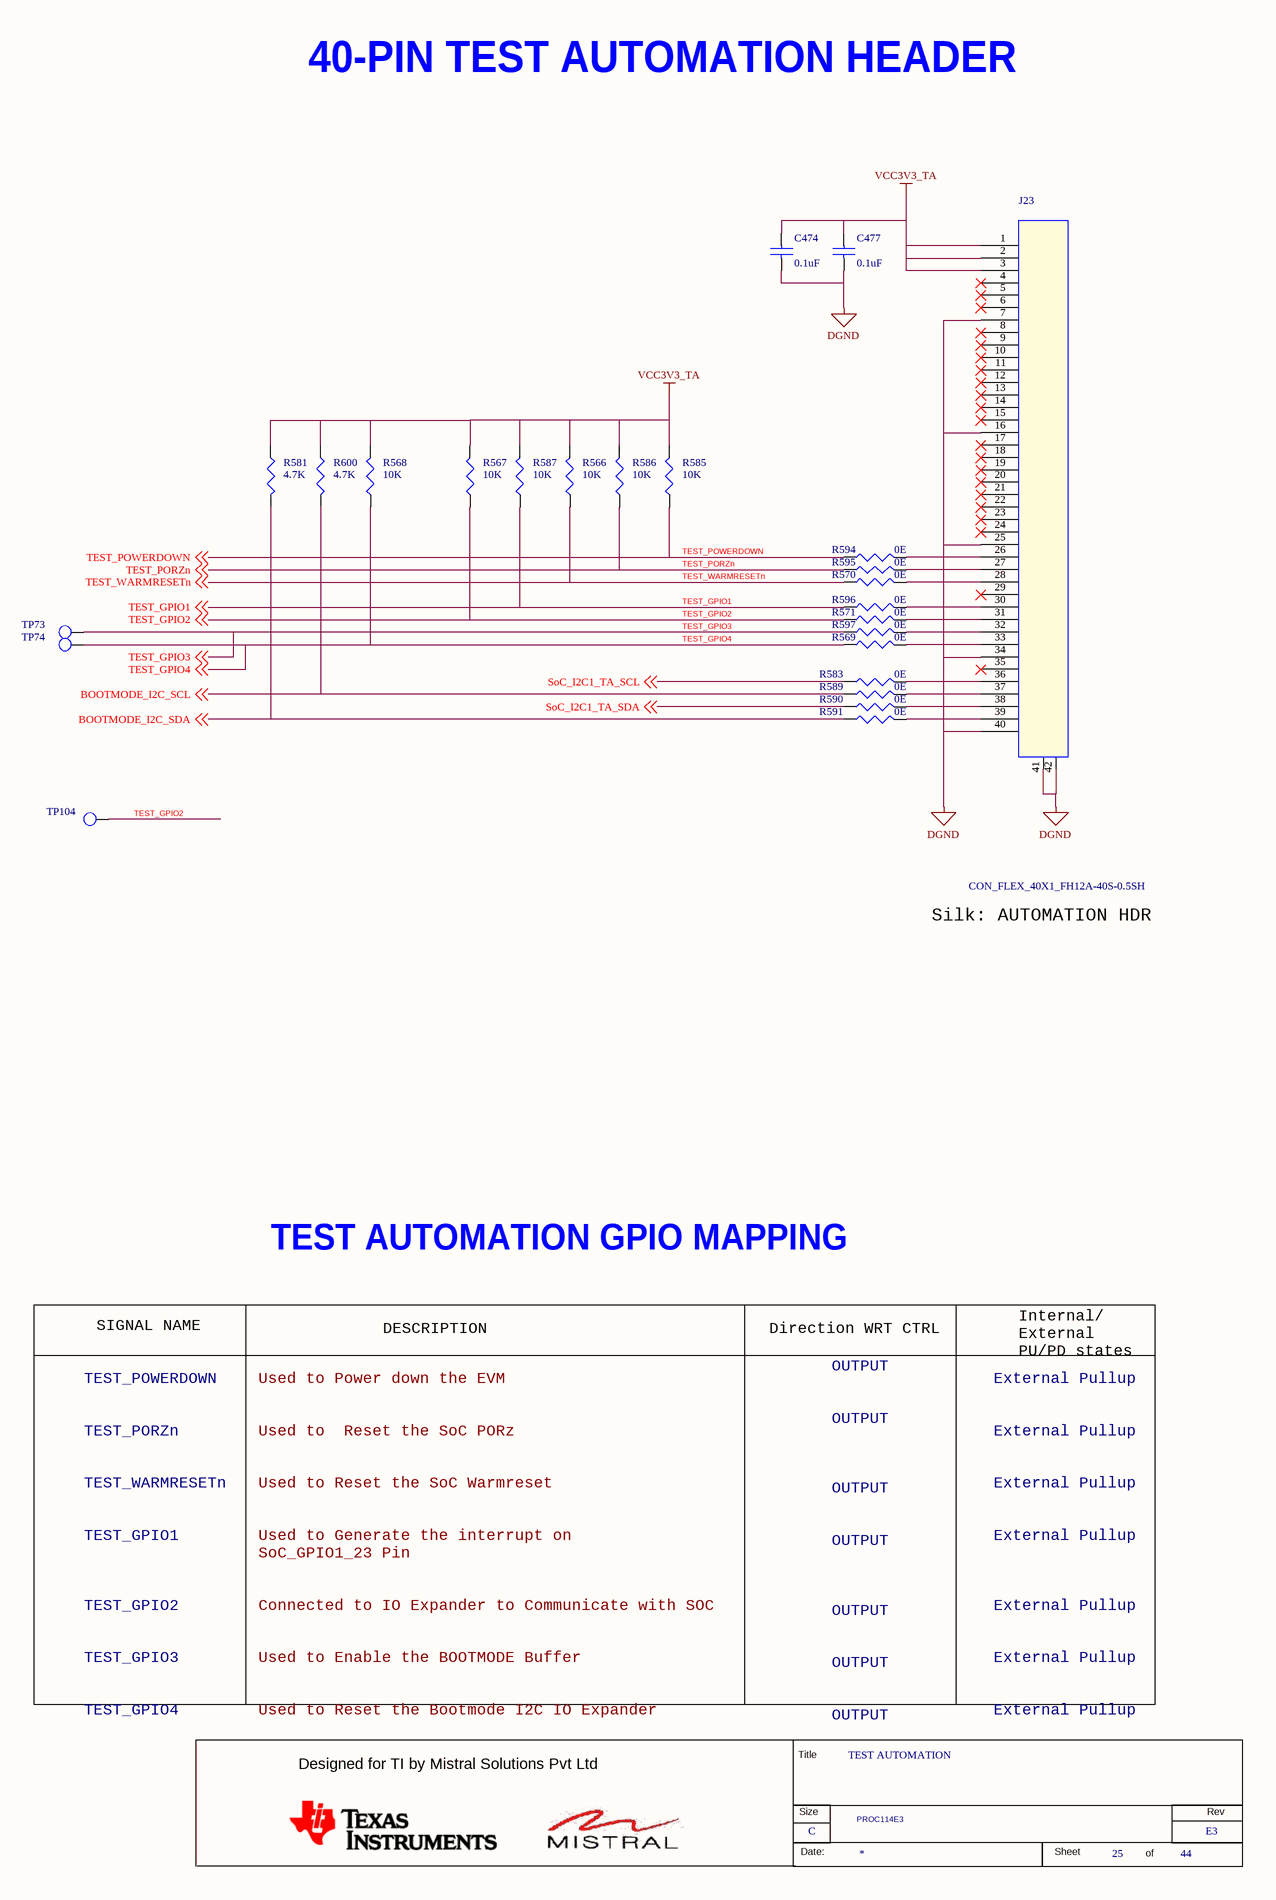
[diagram p40: 25.SchDoc, right]

### Parts
(Parts that share a designator on the sheet are numbered #1, #2 ... from top to bottom, then left to right.)
*#25  RevCode: E3  Title: TEST AUTOMATION  Page Size: C  Page Number: 25  Page Count: 44  Variant Name: PROC114E3  (hidden comment: MISTRAL_TITLEBLK_CSIZE)  (graphical)
C159  0.1uF  [CAP0201_0-5]
C166  0.1uF  [CAP0201_0-5]
C474  0.1uF  [CAP0201_0-5]
C477  0.1uF  [CAP0201_0-5]
C486  22uF  [CAP0603_1]
C491  4.7uF  [CAP0603_1]
J23  CON_FLEX_40X1_FH12A-40S-0.5SH  [CON_FLEX40X1_FH12A_S_R_S]
L14  10uH  [IND_1277AS-H_130X110_SMD_1-2]
R218  10K  [RES0201_0-5]
R498  4.7K  [RES0201_0-5]
R499  4.7K  [RES0201_0-5]
R566  10K  [RES0201_0-5]
R567  10K  [RES0201_0-5]
R568  10K  [RES0201_0-5]
R569  0E  [RES0402_0-5]
R570  0E  [RES0402_0-5]
R571  0E  [RES0402_0-5]
R581  4.7K  [RES0201_0-5]
R583  0E  [RES0402_0-5]
R585  10K  [RES0201_0-5]
R586  10K  [RES0201_0-5]
R587  10K  [RES0201_0-5]
R589  0E  [RES0402_0-5]
R590  0E  [RES0402_0-5]
R591  0E  [RES0402_0-5]
R594  0E  [RES0402_0-5]
R595  0E  [RES0402_0-5]
R596  0E  [RES0402_0-5]
R597  0E  [RES0402_0-5]
R600  4.7K  [RES0201_0-5]
R604  100K_1%  [RES0402_0-5]
R610  0E  [RES0402_0-5]
TP73  TP20_SMD  [TP20_SMD]  (value not drawn)
TP74  TP20_SMD  [TP20_SMD]  (value not drawn)
TP87  TP20_SMD  [TP20_SMD]  (value not drawn)
TP94  TP20_SMD  [TP20_SMD]  (value not drawn)
TP104  TP20_SMD  [TP20_SMD]  (value not drawn)
U42  TCA9801DGK  [VSSOP8_25-59_120X120_1-1]
U94  TPS62177DQCR  [WSON10_19-68_80X120_0-8]

### Blocks framed on the sheet
TEST AUTOMATION BOARD POWER: C486 C491 L14 R604 R610 TP87 TP94 U94

### Nets
DGND: C159.2 C166.2 C474.2 C477.2 C486.2 C491.2 J23.7 J23.16 J23.25 J23.34 J23.40 J23.41 J23.42 U42.4(GND) U94.1(PGND) U94.5(FB) U94.6(AGND) U94.11(EP)
VCC3V3_TA: C166.1 C474.1 C477.1 C486.1 J23.1 J23.2 J23.3 L14.2 R498.1 R499.1 R566.2 R567.2 R568.2 R581.1 R585.2 R586.2 R587.2 R600.1 R604.2 TP87.1(TP) U42.8(VCCB) U94.8(SLEEP) U94.10(VOS)
VCC_3V3_SYS: C159.1 R218.1 U42.1(VCCA)
VMAIN: C491.1 R610.1 U94.2(VIN)
BOOTMODE_I2C_SCL: R589.1 R600.2 ; off-sheet BOOTMODE_I2C_SCL
BOOTMODE_I2C_SDA: R581.2 R591.1 ; off-sheet BOOTMODE_I2C_SDA
SoC_I2C1_SCL: U42.2(SCLA) ; off-sheet SoC_I2C1_SCL
SoC_I2C1_SDA: U42.3(SDAA) ; off-sheet SoC_I2C1_SDA
SoC_I2C1_TA_SCL: R499.2 R583.1 U42.7(SCLB) ; off-sheet SoC_I2C1_TA_SCL
SoC_I2C1_TA_SDA: R498.2 R590.1 U42.6(SDAB) ; off-sheet SoC_I2C1_TA_SDA
TEST_GPIO1: R587.1 R596.1 ; off-sheet TEST_GPIO1
TEST_GPIO2: R567.1 R571.1 TP104.1(TP) ; off-sheet TEST_GPIO2
TEST_GPIO3: R597.1 TP73.1(TP) ; off-sheet TEST_GPIO3
TEST_GPIO4: R568.1 R569.1 TP74.1(TP) ; off-sheet TEST_GPIO4
TEST_PORZn: R586.1 R595.1 ; off-sheet TEST_PORZn
TEST_POWERDOWN: R585.1 R594.1 ; off-sheet TEST_POWERDOWN
TEST_WARMRESETn: R566.1 R570.1 ; off-sheet TEST_WARMRESETn
NetJ23_26: J23.26 R594.2
NetJ23_27: J23.27 R595.2
NetJ23_28: J23.28 R570.2
NetJ23_30: J23.30 R596.2
NetJ23_31: J23.31 R571.2
NetJ23_32: J23.32 R597.2
NetJ23_33: J23.33 R569.2
NetJ23_36: J23.36 R583.2
NetJ23_37: J23.37 R589.2
NetJ23_38: J23.38 R590.2
NetJ23_39: J23.39 R591.2
NetL14_1: L14.1 U94.9(SW)
NetR218_2: R218.2 U42.5(EN)
NetR604_1: R604.1 TP94.1(TP) U94.7(PG)
NetR610_2: R610.2 U94.3(EN)

Not connected (* = marked no-connect by the designer): J23 4* 5* 6* 8* 9* 10* 11* 12* 13* 14* 15* 17* 18* 19* 20* 21* 22* 23* 24* 29* 35*; U94 4(NC)*

### Notes on the sheet
- 40-PIN TEST AUTOMATION HEADER
- I2C BUS BUFFER
- Silk: AUTOMATION HDR
- TEST AUTOMATION GPIO MAPPING
- VinMin = 4.75V
  VinMax = 24V
  Vout = 3.3V @ 0.5A
- SIGNAL NAME
- DESCRIPTION
- Direction WRT CTRL
- Internal/
  External
  PU/PD states
- (near *#25) TEST_POWERDOWN
  TEST_PORZn
  TEST_WARMRESETn
  TEST_GPIO1
  TEST_GPIO2
  TEST_GPIO3
  TEST_GPIO4
- Used to Power down the EVM
  Used to  Reset the SoC PORz
  Used to Reset the SoC Warmreset
  Used to Generate the interrupt on
  SoC_GPIO1_23 Pin
  Connected to IO Expander to Communicate with SOC
  Used to Enable the BOOTMODE Buffer
  Used to Reset the Bootmode I2C IO Expander
- OUTPUT
  OUTPUT
  OUTPUT
  OUTPUT
  OUTPUT
  OUTPUT
  OUTPUT
- External Pullup
  External Pullup
  External Pullup
  External Pullup
  External Pullup
  External Pullup
  External Pullup
- (in symbol MISTRAL_TITLEBLK_CSIZE) Title; Designed for TI by Mistral Solutions Pvt Ltd; Size; Rev; Date:; Sheet; of

### Library data of the parts
*#25 = MISTRAL_TITLEBLK_CSIZE: Issue: 1.0; Page Create Date: March  8, 1995; Page Modify Date: *; Schematic Page Count: 44; Schematic Page Number: 25
C159 C166 C477 = CAP_Dup2: as C325 on sheet 24; PCB Footprint: CAP0201_0-5; Tolerance: 10%; Voltage: 16V; Package: 0201; Distributor_name: DIGIKEY; Distributor_part_number: 490-14305-1-ND; Height: 0.33MM; Weight: 0.33mg; Temperature: -55°C+85°C; Datasheet: Y:\MIS_DATABASE\DATASHEETS\CAPACITORS\GRM033R61C104KE14.PDF; Crtd /date: MANIRAJA/230118; Chkd/date: MANIRAJA/230118; MECHANICAL 3D STEP FILE: CAP0201_0-5; Library Ref: CAP; Footprint Ref: CAP0201_0-5; Library Path: Y:\MIS_DATABASE\Library\ALTIUM_TOOL\SCHEMATICS_PARTS\MS_DISCRETE_Library.schlib; Footprint Path: Y:\MIS_DATABASE\Library\ALTIUM_TOOL\PCB_FOOTPRINTS\Altium_Footprint_Lib.PcbLib
C474 = CAP_Dup2: CAP CERAMIC 0.1uF 16V 10% X5R 0201; Alt_Mfr_name: YAGEO AMERICA; Part_type: CAPACITORS\CERAMIC; Mfr_part_number: GRM033R61C104KE14D; Mfr_name: MURATA; Mistral Part No: 120009030072-R; Alt_Mfr_part_number: CC0402KRX5R8BB104; Custom_Duty: 15%; Customs_HS_Code: 85322990; Wattage: NA; Project: TI_MAXIE_CPB; Footprint Path: Y:\MIS_DATABASE\Library\ALTIUM_TOOL\PCB_FOOTPRINTS\Altium_Footprint_Lib.PcbLib; Library Path: Y:\MIS_DATABASE\Library\ALTIUM_TOOL\SCHEMATICS_PARTS\MS_DISCRETE_Library.schlib; Footprint Ref: CAP0201_0-5; Library Ref: CAP; MECHANICAL 3D STEP FILE: CAP0201_0-5; Chkd/date: MANIRAJA/230118; Crtd /date: MANIRAJA/230118; Datasheet: Y:\MIS_DATABASE\DATASHEETS\CAPACITORS\GRM033R61C104KE14.PDF; Temperature: -55°C+85°C; Weight: 0.33mg; Height: 0.33MM; Distributor_part_number: 490-14305-1-ND; Distributor_name: DIGIKEY; Package: 0201; Voltage: 16V; Tolerance: 10%; PCB Footprint: CAP0201_0-5
C486 = CAP_Dup2: CAP CERAMIC 22uF 10V 20% X5R 0603; Part_type: CAPACITORS\CERAMIC; Mfr_part_number: GRM188R61A226ME15D; Mfr_name: MURATA; Mistral Part No: 120014100009-R; Custom_Duty: 15%; Customs_HS_Code: 85322990; Wattage: NA; Project: TI_MAXIE_CPB; Footprint Path: Y:\MIS_DATABASE\Library\ALTIUM_TOOL\PCB_FOOTPRINTS\Altium_Footprint_Lib.PcbLib; Library Path: Y:\MIS_DATABASE\Library\ALTIUM_TOOL\SCHEMATICS_PARTS\MS_DISCRETE_Library.schlib; Footprint Ref: CAP0603_1; MECHANICAL 3D STEP FILE: CAP0603_1; Chkd/date: MANIRAJA/230118; Crtd /date: MANIRAJA/230118; Datasheet: Y:\MIS_DATABASE\DATASHEETS\CAPACITORS\GRM188R61A226ME15.PDF; Temperature: -55°C+85°C; Weight: 6.3mg; Height: 1.00MM; Library Ref: CAP; Distributor_part_number: 490-10476-1-ND; Distributor_name: DIGIKEY; Package: 0603; Voltage: 10V; Tolerance: 20%; PCB Footprint: CAP0603_1
C491 = CAP: CAP CERAMIC 4.7uF 35V 20% X5R 0603; Mistral Part No: 120020050017-R; Mfr_name: MURATA; Mfr_part_number: GRM188R6YA475ME15D; Part_type: CAPACITORS\CERAMIC; Project: SD865_NANOSOM; Wattage: NA; Customs_HS_Code: 85322990; Custom_Duty: 15%; Footprint Ref: CAP0603_1; Tolerance: 20%; Voltage: 35V; Package: 0603; Distributor_name: DIGIKEY; Distributor_part_number: 490-11995-1-ND; Library Ref: CAP; Height: 1.00MM; Weight: 6.3mg; Temperature: -55°C+85°C; Datasheet: Y:\MIS_DATABASE\DATASHEETS\CAPACITORS\GRM188R6YA475ME15.PDF; Crtd /date: ALVY/120520; Chkd/date: MANIRAJA/120520; MECHANICAL 3D STEP FILE: CAP0603_1; Library Path: Y:\MIS_DATABASE\Library\ALTIUM_TOOL\SCHEMATICS_PARTS\MS_DISCRETE_Library.schlib; Footprint Path: Y:\MIS_DATABASE\Library\ALTIUM_TOOL\PCB_FOOTPRINTS\Altium_Footprint_Lib.PcbLib; PCB Footprint: CAP0603_1
J23 = CON_FLEX_40X1_FH12A-40S-0.5SH: CON FPC 40X1 0.50MM PITCH RT TOP SMD; Mistral Part No: 150009030176-R; Mfr_name: HIROSE ELECTRIC EUROPE; Mfr_part_number: FH12A-40S-0.5SH(55); Part_type: CONNECTOR\FPC; Project: PMP LCD BOARD; Customs_HS_Code: 85369090; Custom_Duty: 24%; Package: SMD; Distributor_name: DIGIKEY; Distributor_part_number: HFK40CT-ND; Height: 2.00MM; Datasheet: Y:\MIS_DATABASE\DATASHEETS\CONNECTORS\FH12SERIES.PDF; Crtd /date: MAZHAR/171106; Chkd/date: SHREESHAIL/201106; Library Ref: CON_FLEX_40X1_FH12A-40S-0.5SH; PCB Footprint: CON_FLEX40X1_FH12A_S_R_S
L14 = INDUCTOR: IND POWER 10uH 900mA 20% SMD; Mfr_part_number: 1277AS-H-100M=P2; Mfr_name: MURATA; Mistral Part No: 130021090022-R; Custom_Duty: 24%; Customs_HS_Code: 85369090; Wattage: NA; Project: TI_AM62x SKEVM_BRD; MECHANICAL 3D STEP FILE: IND_1277AS-H_130X110_SMD_1-2; Chkd/date: MANIRAJA/200921; Crtd /date: ALVY/200921; Datasheet: Y:\MIS_DATABASE\DATASHEETS\DISCRETES\INDUCTORS\MURATA-1277AS-H.PDF; Temperature: -40°C+85°C; Weight: NA; Height: 1.20MM; Library Ref: INDUCTOR; Distributor_part_number: 490-10589-1-ND; Distributor_name: DIGIKEY; Package: SMD; Voltage: NA; Tolerance: 20%; Part_type: INDUCTOR; Footprint Ref: IND_1277AS-H_130X110_SMD_1-2; Library Path: Y:\MIS_DATABASE\Library\ALTIUM_TOOL\SCHEMATICS_PARTS\MS_DISCRETE_Library.schlib; Footprint Path: Y:\MIS_DATABASE\Library\ALTIUM_TOOL\PCB_FOOTPRINTS\Altium_Footprint_Lib.PcbLib; PCB Footprint: IND_1277AS-H_130X110_SMD_1-2
R218 R568 = RESISTOR_Dup6: as R160 on sheet 24; MECHANICAL 3D STEP FILE: RES0201_0-5; Chkd/date: MANIRAJA/050517; Crtd /date: MANIRAJA/050517; Datasheet: Y:\MIS_DATABASE\DATASHEETS\RESISTORS\RCXXXXL-SER_MAR18.PDF; Temperature: -55°C+125°C; Weight: 0.17mg; Height: 0.26MM; Distributor_part_number: 311-10KNCT-ND; Distributor_name: DIGIKEY; Package: 0201; Wattage: 1/20W; Tolerance: 5%; Library Ref: RESISTOR; Footprint Ref: RES0201_0-5; Library Path: Y:\MIS_DATABASE\Library\ALTIUM_TOOL\SCHEMATICS_PARTS\MS_DISCRETE_Library.schlib; Footprint Path: Y:\MIS_DATABASE\Library\ALTIUM_TOOL\PCB_FOOTPRINTS\Altium_Footprint_Lib.PcbLib; PCB Footprint: RES0201_0-5
R498 R499 R581 = RESISTOR_Dup6: RES 4.7K 1/20W 5% 0201; Part_type: RESISTORS\FIXED; Mfr_part_number: RC0201JR-074K7L; Mfr_name: YAGEO AMERICA; Mistral Part No: 110021090007-R; Custom_Duty: 15%; Customs_HS_Code: 85332119; Voltage: NA; Project: TI_AM62x SKEVM_BRD; PCB Footprint: RES0201_0-5; Footprint Path: Y:\MIS_DATABASE\Library\ALTIUM_TOOL\PCB_FOOTPRINTS\Altium_Footprint_Lib.PcbLib; Library Path: Y:\MIS_DATABASE\Library\ALTIUM_TOOL\SCHEMATICS_PARTS\MS_DISCRETE_Library.schlib; MECHANICAL 3D STEP FILE: RES0201_0-5; Chkd/date: MANIRAJA/200921; Crtd /date: ALVY/200921; Datasheet: Y:\MIS_DATABASE\DATASHEETS\RESISTORS\RCXXXXL-SER_MAR18.PDF; Temperature: -55°C+125°C; Weight: 0.17mg; Height: 0.26MM; Library Ref: RESISTOR; Distributor_part_number: 311-4.7KNCT-ND; Distributor_name: DIGIKEY; Package: 0201; Wattage: 1/20W; Tolerance: 5%; Footprint Ref: RES0201_0-5
R566 R567 R585-R587 = RESISTOR_Dup6: as R162 on sheet 24; Footprint Path: Y:\MIS_DATABASE\Library\ALTIUM_TOOL\PCB_FOOTPRINTS\Altium_Footprint_Lib.PcbLib; Library Path: Y:\MIS_DATABASE\Library\ALTIUM_TOOL\SCHEMATICS_PARTS\MS_DISCRETE_Library.schlib; Footprint Ref: RES0201_0-5; Library Ref: RESISTOR; Tolerance: 5%; Wattage: 1/20W; Package: 0201; Distributor_name: DIGIKEY; Distributor_part_number: 311-10KNCT-ND; Height: 0.26MM; Weight: 0.17mg; Temperature: -55°C+125°C; Datasheet: Y:\MIS_DATABASE\DATASHEETS\RESISTORS\RCXXXXL-SER_MAR18.PDF; Crtd /date: MANIRAJA/050517; Chkd/date: MANIRAJA/050517; MECHANICAL 3D STEP FILE: RES0201_0-5; PCB Footprint: RES0201_0-5
R569 R571 R596 R597 = RESISTOR_Dup6: RES 0E 1/16W JUMPER 0402; Mistral Part No: 110010080019-R; Mfr_name: VISHAY; Mfr_part_number: CRCW04020000Z0ED; Part_type: RESISTORS\FIXED; Project: PB_BUGBASE; Tolerance: NA; Customs_HS_Code: 85332119; Custom_Duty: 15%; Footprint Ref: RES0402_0-5; Voltage: NA; Wattage: 1/16W; Package: 0402; Distributor_name: DIGIKEY; Distributor_part_number: 541-0.0JCT-ND; Library Ref: RESISTOR; Height: 0.40MM; Weight: 0.65mg; Temperature: -55°C+155°C; Datasheet: Y:\MIS_DATABASE\DATASHEETS\RESISTORS\CRCW0603.PDF; Crtd /date: MUDDU/190810; Chkd/date: VASANTHA/201216; MECHANICAL 3D STEP FILE: RES0402_0-5; Library Path: Y:\MIS_DATABASE\Library\ALTIUM_TOOL\SCHEMATICS_PARTS\MS_DISCRETE_Library.schlib; Footprint Path: Y:\MIS_DATABASE\Library\ALTIUM_TOOL\PCB_FOOTPRINTS\Altium_Footprint_Lib.PcbLib; PCB Footprint: RES0402_0-5
R570 R583 R589-R591 R594 R595 = RESISTOR_Dup6: RES 0E 1/16W JUMPER 0402; Part_type: RESISTORS\FIXED; Mfr_part_number: CRCW04020000Z0ED; Mfr_name: VISHAY; Mistral Part No: 110010080019-R; Custom_Duty: 15%; Customs_HS_Code: 85332119; Voltage: NA; Project: PB_BUGBASE; Footprint Path: Y:\MIS_DATABASE\Library\ALTIUM_TOOL\PCB_FOOTPRINTS\Altium_Footprint_Lib.PcbLib; Library Path: Y:\MIS_DATABASE\Library\ALTIUM_TOOL\SCHEMATICS_PARTS\MS_DISCRETE_Library.schlib; MECHANICAL 3D STEP FILE: RES0402_0-5; Chkd/date: VASANTHA/201216; Crtd /date: MUDDU/190810; Datasheet: Y:\MIS_DATABASE\DATASHEETS\RESISTORS\CRCW0603.PDF; Temperature: -55°C+155°C; Weight: 0.65mg; Height: 0.40MM; Library Ref: RESISTOR; Distributor_part_number: 541-0.0JCT-ND; Distributor_name: DIGIKEY; Package: 0402; Wattage: 1/16W; Tolerance: NA; Footprint Ref: RES0402_0-5; PCB Footprint: RES0402_0-5
R600 = RESISTOR_Dup6: RES 4.7K 1/20W 5% 0201; Mistral Part No: 110021090007-R; Mfr_name: YAGEO AMERICA; Mfr_part_number: RC0201JR-074K7L; Part_type: RESISTORS\FIXED; Project: TI_AM62x SKEVM_BRD; Voltage: NA; Customs_HS_Code: 85332119; Custom_Duty: 15%; Footprint Ref: RES0201_0-5; Tolerance: 5%; Wattage: 1/20W; Package: 0201; Distributor_name: DIGIKEY; Distributor_part_number: 311-4.7KNCT-ND; Library Ref: RESISTOR; Height: 0.26MM; Weight: 0.17mg; Temperature: -55°C+125°C; Datasheet: Y:\MIS_DATABASE\DATASHEETS\RESISTORS\RCXXXXL-SER_MAR18.PDF; Crtd /date: ALVY/200921; Chkd/date: MANIRAJA/200921; MECHANICAL 3D STEP FILE: RES0201_0-5; Library Path: Y:\MIS_DATABASE\Library\ALTIUM_TOOL\SCHEMATICS_PARTS\MS_DISCRETE_Library.schlib; Footprint Path: Y:\MIS_DATABASE\Library\ALTIUM_TOOL\PCB_FOOTPRINTS\Altium_Footprint_Lib.PcbLib; PCB Footprint: RES0201_0-5
R604 = RESISTOR_Dup6: RES 100K 1/10W 1% 0402; Part_type: RESISTORS\FIXED; Mfr_part_number: ERJ-2RKF1003X; Mfr_name: PANASONIC-ECG; Mistral Part No: 110009030187-R; Custom_Duty: 15%; Customs_HS_Code: 85332119; Voltage: NA; Project: J32; MECHANICAL 3D STEP FILE: RES0402_0-5; Chkd/date: VASANTHA/201216; Crtd /date: MAZHAR/130306; Datasheet: Y:\MIS_DATABASE\DATASHEETS\RESISTORS\PAN-ERJSER_NOV17.PDF; Temperature: -55°C+155°C; Weight: 0.8mg; Height: 0.40MM; Distributor_part_number: P100KLCT-ND; Distributor_name: DIGIKEY; Package: 0402; Wattage: 1/10W; Tolerance: 1%; Library Ref: RESISTOR; Footprint Ref: RES0402_0-5; Library Path: Y:\MIS_DATABASE\Library\ALTIUM_TOOL\SCHEMATICS_PARTS\MS_DISCRETE_Library.schlib; Footprint Path: Y:\MIS_DATABASE\Library\ALTIUM_TOOL\PCB_FOOTPRINTS\Altium_Footprint_Lib.PcbLib; PCB Footprint: RES0402_0-5
R610 = RESISTOR_Dup4: RES 0E 1/16W JUMPER 0402; Part_type: RESISTORS\FIXED; Mfr_part_number: CRCW04020000Z0ED; Mfr_name: VISHAY; Mistral Part No: 110010080019-R; Custom_Duty: 15%; Customs_HS_Code: 85332119; Voltage: NA; Project: PB_BUGBASE; Footprint Path: Y:\MIS_DATABASE\Library\ALTIUM_TOOL\PCB_FOOTPRINTS\Altium_Footprint_Lib.PcbLib; Library Path: Y:\MIS_DATABASE\Library\ALTIUM_TOOL\SCHEMATICS_PARTS\MS_DISCRETE_Library.schlib; Footprint Ref: RES0402_0-5; Library Ref: RESISTOR; Chkd/date: VASANTHA/201216; Crtd /date: MUDDU/190810; Datasheet: Y:\MIS_DATABASE\DATASHEETS\RESISTORS\CRCW0603.PDF; Temperature: -55°C+155°C; Weight: 0.65mg; Height: 0.40MM; Distributor_part_number: 541-0.0JCT-ND; Distributor_name: DIGIKEY; Package: 0402; Wattage: 1/16W; Tolerance: NA; MECHANICAL 3D STEP FILE: RES0402_0-5; PCB Footprint: RES0402_0-5
TP73 = TESTPOINT: TESTPOINT CIR 20 SMD; Mfr_name: LOCAL; Custom_Duty: NA; Project: BT MODULE_CSRBC04; Customs_HS_Code: NA; RoHS: NA; Footprint Ref: TP20_SMD; Library Ref: TESTPOINT; Mistral Part No: NA; Mfr_part_number: TP20_SMD; Part_type: TESTPOINT; Package: SMD; Distributor_name: NA; Distributor_part_number: NA; Height: NA; Crtd /date: MAZHAR/171006; Chkd/date: SHREESHAIL/171006; Tolerance: NA; Voltage: NA; Wattage: NA; Weight: NA; Temperature: NA; Datasheet: NA; MECHANICAL 3D STEP FILE: NA; Library Path: Y:\MIS_DATABASE\Library\ALTIUM_TOOL\SCHEMATICS_PARTS\MS_DISCRETE_Library.schlib; Footprint Path: Y:\MIS_DATABASE\Library\ALTIUM_TOOL\PCB_FOOTPRINTS\Altium_Footprint_Lib.PcbLib; PCB Footprint: TP20_SMD
TP74 TP94 TP104 = TESTPOINT: TESTPOINT CIR 20 SMD; Mfr_name: LOCAL; MECHANICAL 3D STEP FILE: NA; Project: BT MODULE_CSRBC04; Footprint Path: Y:\MIS_DATABASE\Library\ALTIUM_TOOL\PCB_FOOTPRINTS\Altium_Footprint_Lib.PcbLib; Library Path: Y:\MIS_DATABASE\Library\ALTIUM_TOOL\SCHEMATICS_PARTS\MS_DISCRETE_Library.schlib; Datasheet: NA; Temperature: NA; Weight: NA; Wattage: NA; Voltage: NA; Tolerance: NA; Chkd/date: SHREESHAIL/171006; Crtd /date: MAZHAR/171006; Height: NA; Distributor_part_number: NA; Distributor_name: NA; Package: SMD; Part_type: TESTPOINT; Mfr_part_number: TP20_SMD; Mistral Part No: NA; Library Ref: TESTPOINT; Footprint Ref: TP20_SMD; RoHS: NA; Customs_HS_Code: NA; Custom_Duty: NA; PCB Footprint: TP20_SMD
TP87 = TESTPOINT: TESTPOINT CIR 20 SMD; Mistral Part No: NA; Mfr_name: LOCAL; Project: BT MODULE_CSRBC04; RoHS: NA; Footprint Ref: TP20_SMD; Library Ref: TESTPOINT; Mfr_part_number: TP20_SMD; Part_type: TESTPOINT; Package: SMD; Distributor_name: NA; Distributor_part_number: NA; Height: NA; Crtd /date: MAZHAR/171006; Chkd/date: SHREESHAIL/171006; Tolerance: NA; Voltage: NA; Wattage: NA; Weight: NA; Temperature: NA; Datasheet: NA; MECHANICAL 3D STEP FILE: NA; Library Path: Y:\MIS_DATABASE\Library\ALTIUM_TOOL\SCHEMATICS_PARTS\MS_DISCRETE_Library.schlib; Footprint Path: Y:\MIS_DATABASE\Library\ALTIUM_TOOL\PCB_FOOTPRINTS\Altium_Footprint_Lib.PcbLib; Customs_HS_Code: NA; Custom_Duty: NA; PCB Footprint: TP20_SMD
U42 = TCA9801DGK_VSSOP8: IC LEVEL TRANSLATING I2C BUS BUFFER/REPEATER VSSOP8; Mistral Part No: 141018070002-R; Mfr_name: TEXAS INSTRUMENTS; Mfr_part_number: TCA9801DGKT; Part_type: ICS\INTERFACE\LEVEL TRANSLATOR; Project: DARE_RFAM_RF; Tolerance: NA; Customs_HS_Code: 85423100; Custom_Duty: 15%; Footprint Ref: VSSOP8_25-59_120X120_1-1; Voltage: NA; Wattage: NA; Package: VSSOP8; Distributor_name: DIGIKEY; Distributor_part_number: 296-46571-1-ND; Library Ref: TCA9801DGK_VSSOP8; Height: 1.10MM; Weight: 20mg; Temperature: -40°C+85°C; Datasheet: Y:\MIS_DATABASE\DATASHEETS\ICS\INTERFACE\TCA9801DGK.PDF; Crtd /date: MANIRAJA/020718; Chkd/date: MANIRAJA/020718; MECHANICAL 3D STEP FILE: VSSOP8_25-59_120X120_1-1; Library Path: Y:\MIS_DATABASE\Library\ALTIUM_TOOL\SCHEMATICS_PARTS\MS_MISCINTERFACE_Library.schlib; Footprint Path: Y:\MIS_DATABASE\Library\ALTIUM_TOOL\PCB_FOOTPRINTS\Altium_Footprint_Lib.PcbLib; PCB Footprint: VSSOP8_25-59_120X120_1-1
U94 = TPS62177_WSON10: IC 3.3V 0.5A STEP DOWN CONVERTER WITH SLEEP MODE WSON10; Part_type: ICS\POWER\DC-DC CONVERTER; Mfr_name: TEXAS INSTRUMENTS; Mistral Part No: 142019070007-R; Custom_Duty: 15%; Customs_HS_Code: 85423100; Wattage: NA; Project: TI_MAXIE_CPB; Footprint Path: Y:\MIS_DATABASE\Library\ALTIUM_TOOL\PCB_FOOTPRINTS\Altium_Footprint_Lib.PcbLib; Library Path: Y:\MIS_DATABASE\Library\ALTIUM_TOOL\SCHEMATICS_PARTS\MS_MISCPOWER_Library.schlib; MECHANICAL 3D STEP FILE: WSON10_19-68_80X120_0-8; Chkd/date: MANIRAJA/170719; Crtd /date: MANIRAJA/170719; Datasheet: Y:\MIS_DATABASE\DATASHEETS\ICS\POWER\TPS62177.PDF; Temperature: -40°C+85°C; Weight: 15mg; Height: 0.80MM; Footprint Ref: WSON10_19-68_80X120_0-8; Library Ref: TPS62177_WSON10; Distributor_part_number: 296-41856-1-ND; Distributor_name: DIGIKEY; Package: WSON10; Voltage: NA; Tolerance: NA; Mfr_part_number: TPS62177DQCR; PCB Footprint: WSON10_19-68_80X120_0-8